# EAGLE design mcp23008-board (EAGLE 6.1)
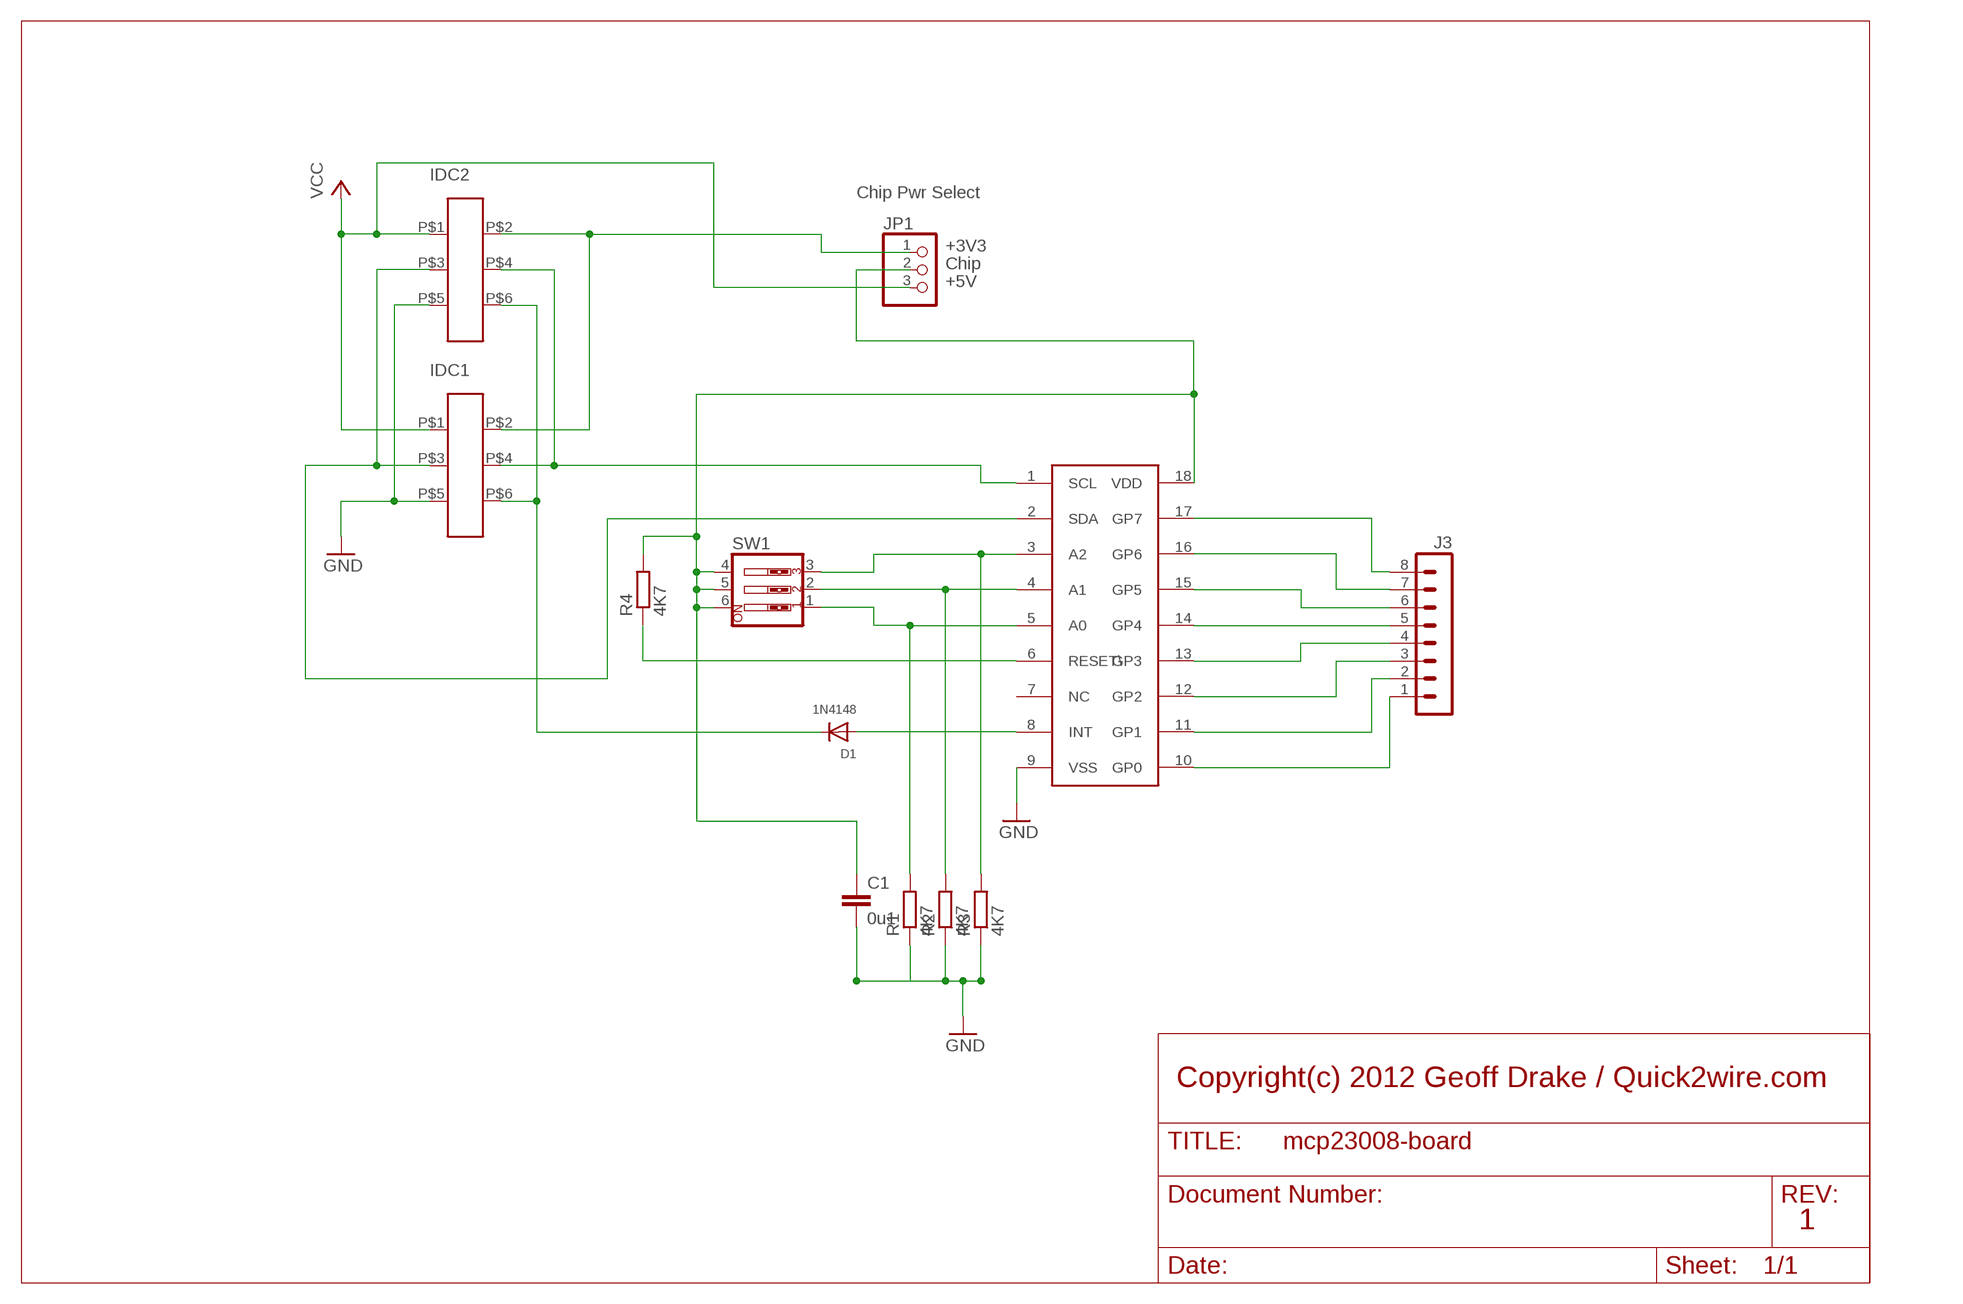
[diagram p0: schematic, sheet 1]

## Parts
C1  0u1  C-EU025-030X050  [C025-030X050]
D1  1N4148  DIODEDO-1N4148  [DO-1N4148]
IC1  MCP23008  [DIL18]
IDC1  IDC-6W  [IDC-6W]
IDC2  IDC-6W  [IDC-6W]
J3  MA08-1  [MA08-1]
JP1  PINHD-1X3  [1X03]
R1  4K7  R-EU_0207/10  [0207/10]
R2  4K7  R-EU_0207/10  [0207/10]
R3  4K7  R-EU_0207/10  [0207/10]
R4  4K7  R-EU_0207/10  [0207/10]
SW1  SW_DIP-3  [EDG-03]

## Nets
A0: IC1.5(A0) R1.2 SW1.1
A1: IC1.4(A1) R2.2 SW1.2
A2: IC1.3(A2) R3.2 SW1.3
GND [pwr]: C1.2 IC1.9(VSS) IDC1.P$5 IDC2.P$5 R1.1 R2.1 R3.1
GP0: IC1.10(GP0) J3.1
GP1: IC1.11(GP1) J3.2
GP2: IC1.12(GP2) J3.3
GP3: IC1.13(GP3) J3.4
GP4: IC1.14(GP4) J3.5
GP5: IC1.15(GP5) J3.6
GP6: IC1.16(GP6) J3.7
GP7: IC1.17(GP7) J3.8
INT: D1.A IC1.8(INT)
N$1: IC1.2(SDA) IDC1.P$3 IDC2.P$3
N$2: IC1.1(SCL) IDC1.P$4 IDC2.P$4
N$3: D1.C IDC1.P$6 IDC2.P$6
N$4: IDC1.P$2 IDC2.P$2 JP1.1
N$5 [pwr]: C1.1 IC1.18(VDD) JP1.2 R4.2 SW1.4 SW1.5 SW1.6
N$6 [pwr]: IC1.6(RESET\) R4.1
VCC [pwr]: IDC1.P$1 IDC2.P$1 JP1.3
Unconnected: IC1.7(NC)

## Notes on the sheet
- Chip Pwr Select
- +3V3
- Chip
- +5V
- Copyright(c) 2012 Geoff Drake / Quick2wire.com
- 1

## Library data of the parts
C1 = rcl:C-EU: CAPACITOR, European symbol
D1 = adafruit:DIODE: Diode SMADIODE - SMA Surface Mount Package 20V 1A Schottky Diode Digikey: 641-1014-6-ND DO-1N4148 - Through Hole Small Current Diode SOD-123 20V 1 A (.5mV Vf) Schottky Diode - Digikey: MBRX120TPMSCT-ND SOD-323 10V 570mA (.38mV Vf, 3ns) Schottky Diode - Digikey: ZLLS410CT-ND SOD-523 30V 30mA Schottky Diode (RB751S-40TE61) - Digikey: RB751S-40TE61CT-ND SOT23-R/W - SOT23 Package (R = Solder Paste/Reflow Ovens, W = Hand-Soldering) BAT54Film 40V 300mA - Digikey: 497-7162-1-ND
IC1 = quick2wire:MCP23008
IDC1 IDC2 = quick2wire:IDC-6W: 6 Way IDC Connector
J3 = con-lstb:MA08-1: PIN HEADER; OC_FARNELL: unknown; OC_NEWARK: unknown
JP1 = adafruit:PINHD-1X3: PIN HEADER
R1-R4 = rcl:R-EU_: RESISTOR, European symbol
SW1 = special:SW_DIP-3: DIP SWITCH

## Net classes
0 default: clearance 0.254 mm
1 pwr: width 0.305 mm, clearance 0.356 mm

## Board
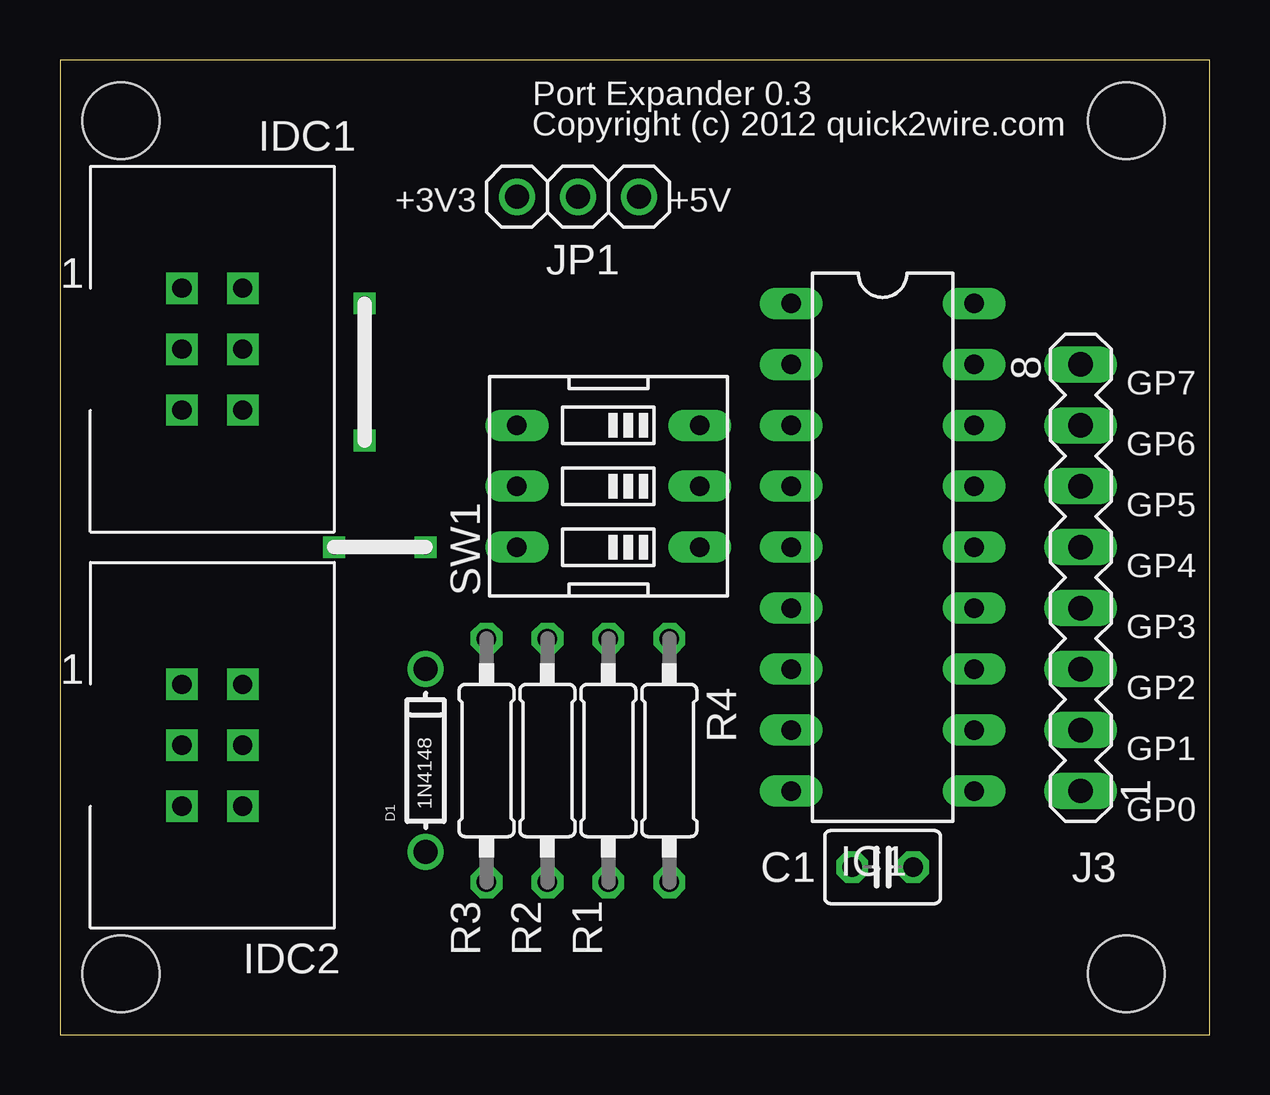
[diagram p1: board, top side]
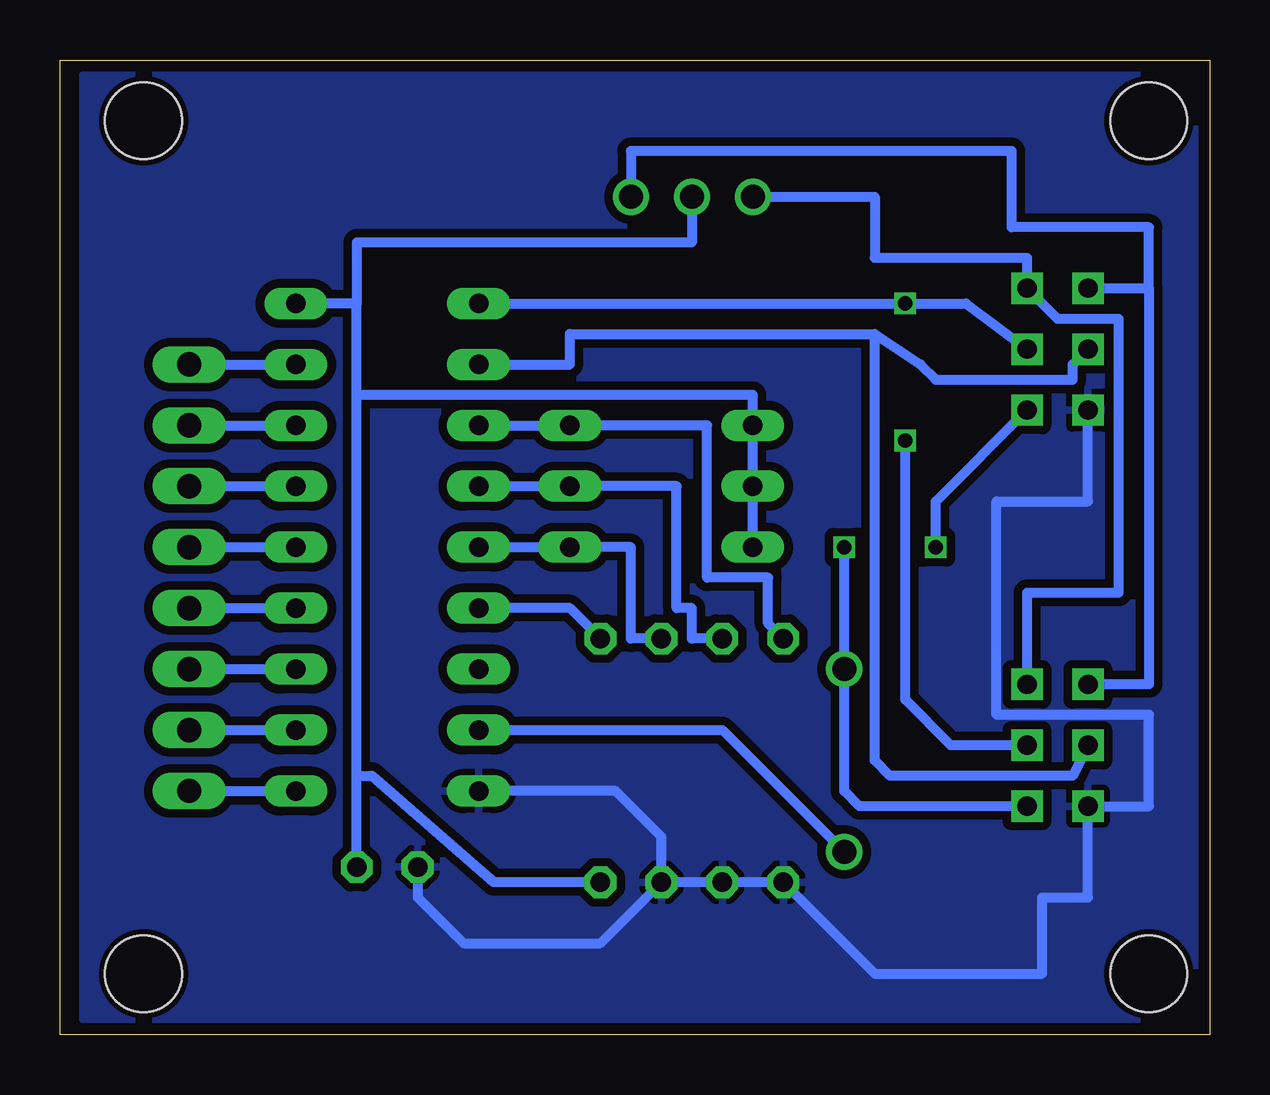
[diagram p2: board, bottom side, seen from below]

Size 47.93 x 40.63 mm. Coordinates in mm from the lower left corner, seen from the top.
Outline: 0,0 47.93,0 47.93,40.63 0,40.63 0,0
Copper layers (1*16): Top 0.035mm / dielectric 1.5mm / Bottom 0.035mm
Design rules: minimum track width 6mil, minimum drill 12mil, track to track 6mil, track to pad 6mil, pad to pad 6mil, via to via 6mil, smd to smd 0mil, copper to edge 10mil, drill to drill 10mil, minimum pad ring 10mil, minimum via ring 6mil, stop-mask expansion 2mil, vias tented up to drill 100mil, thermal gap 10mil
Holes 3.2 mm at 44.45,38.1 44.45,2.54 2.54,2.54 2.54,38.1

### Footprints (pad centres in the part's own frame; a part is rotated, then mirrored left to right if it is on the bottom)
C025-030X050 = drill 0.813 octagon: 1 -1.27,0; 2 1.27,0
DO-1N4148 = drill 1: A -3.81,0; C 3.81,0
DIL18 = drill 0.813 long: 1 -10.16,-3.81; 2 -7.62,-3.81; 3 -5.08,-3.81; 4 -2.54,-3.81; 5 0,-3.81; 6 2.54,-3.81; 7 5.08,-3.81; 8 7.62,-3.81; 9 10.16,-3.81; 10 10.16,3.81; 11 7.62,3.81; 12 5.08,3.81; 13 2.54,3.81; 14 0,3.81; 15 -2.54,3.81; 16 -5.08,3.81; 17 -7.62,3.81; 18 -10.16,3.81
IDC-6W = drill 0.8 square: P$1 -1.27,2.54; P$2 1.27,2.54; P$3 -1.27,0; P$4 1.27,0; P$5 -1.27,-2.54; P$6 1.27,-2.54
MA08-1 = drill 1.016 long: 1 -8.89,0; 2 -6.35,0; 3 -3.81,0; 4 -1.27,0; 5 1.27,0; 6 3.81,0; 7 6.35,0; 8 8.89,0
1X03 = drill 1: 1 -2.54,0; 2 0,0; 3 2.54,0
0207/10 = drill 0.813 octagon: 1 -5.08,0; 2 5.08,0
EDG-03 = drill 0.813 long: 1 -2.54,-3.81; 2 0,-3.81; 3 2.54,-3.81; 4 2.54,3.81; 5 0,3.81; 6 -2.54,3.81

### Placement (x,y rotation side)
C1  34.29,6.99 180 top
D1  15.24,11.43 90 top
IC1  34.29,20.32 270 top
IDC1  6.35,28.57 0 top
IDC2  6.35,12.06 0 top
J3  42.55,19.05 90 top
JP1  21.59,34.92 0 top
R1  22.86,11.43 90 top
R2  20.32,11.43 90 top
R3  17.78,11.43 90 top
R4  25.4,11.43 270 top
SW1  22.86,22.86 90 top

### Tracks (layer width: path | path; a pad name or v marks a point on that pad's centre or on a via)
A0
  Bottom 0.406: IC1.5 SW1.1 24.13,20.32 24.13,16.51 R1.2
A1
  Bottom 0.406: IC1.4 SW1.2 22.23,22.86 22.23,17.78 21.59,17.78 21.59,16.51 R2.2
A2
  Bottom 0.406: IC1.3 SW1.3 20.95,25.4 20.95,19.05 18.41,19.05 18.41,17.14 R3.2
GND
  Bottom 0.406: R1.1 R2.1 R3.1 13.97,2.54 6.99,2.54 6.99,5.71 5.08,5.71 IDC2.P$5 2.54,9.53 2.54,13.34 8.89,13.34 8.89,22.23 5.08,22.23 IDC1.P$5 | R1.1 22.86,8.26 24.77,10.16 IC1.9 | C1.2 33.02,5.71 31.11,3.81 25.4,3.81 R1.1
  pour Bottom: 0.64,40.01 46.99,40.01 46.99,0.64 0.64,0.64
GP0
  Bottom 0.406: J3.1 IC1.10
GP1
  Bottom 0.406: J3.2 IC1.11
GP2
  Bottom 0.406: J3.3 IC1.12
GP3
  Bottom 0.406: J3.4 IC1.13
GP4
  Bottom 0.406: J3.5 IC1.14
GP5
  Bottom 0.406: J3.6 IC1.15
GP6
  Bottom 0.406: J3.7 IC1.16
GP7
  Bottom 0.406: J3.8 IC1.17
INT
  Bottom 0.406: IC1.8 20.32,12.7 D1.A
N$1
  Bottom 0.406: IC1.2 26.67,27.94 26.67,29.21 13.97,29.21 | 13.97,29.21 12.06,27.94 11.43,27.3 5.71,27.3 5.71,27.94 IDC1.P$3 | IDC2.P$3 5.71,10.79 13.34,10.79 13.97,11.43 13.97,29.21
N$2  (via drill 0.6)
  Top 0.406: v12.7,24.77 v12.7,30.48
  Bottom 0.406: IC1.1 v12.7,30.48 10.16,30.48 IDC1.P$4 | IDC2.P$4 10.79,12.06 12.7,13.97 v12.7,24.77
N$3  (via drill 0.6)
  Top 0.406: v15.24,20.32 v11.43,20.32
  Bottom 0.406: IDC2.P$6 14.61,9.53 15.24,10.16 D1.C v15.24,20.32 | v11.43,20.32 11.43,22.23 IDC1.P$6
N$4
  Bottom 0.406: JP1.1 13.97,34.92 13.97,32.38 7.62,32.38 IDC1.P$2 6.35,29.84 3.81,29.84 3.81,18.41 7.62,18.41 IDC2.P$2
N$5
  Bottom 0.406: 35.56,26.67 C1.1 35.56,10.79 34.92,10.79 29.84,6.35 R4.2 | 35.56,26.67 35.56,30.48 | 35.56,30.48 IC1.18 | JP1.2 21.59,33.02 35.56,33.02 35.56,30.48 | SW1.6 SW1.5 SW1.4 19.05,26.67 35.56,26.67
N$6
  Bottom 0.406: R4.1 26.67,17.78 IC1.6
VCC
  Bottom 0.406: 2.54,31.11 2.54,14.61 IDC2.P$1 | IDC1.P$1 2.54,31.11 | 2.54,31.11 2.54,33.66 8.26,33.66 8.26,36.83 24.13,36.83 JP1.3

### Text on the board
tPlace: Port Expander 0.3 | Copyright (c) 2012 quick2wire.com
tNames: +3V3 | +5V | GP7 | GP6 | GP5 | GP4 | GP3 | GP2 | GP1 | GP0